# EAGLE design novice_shield_v1 (EAGLE 6.5.0)
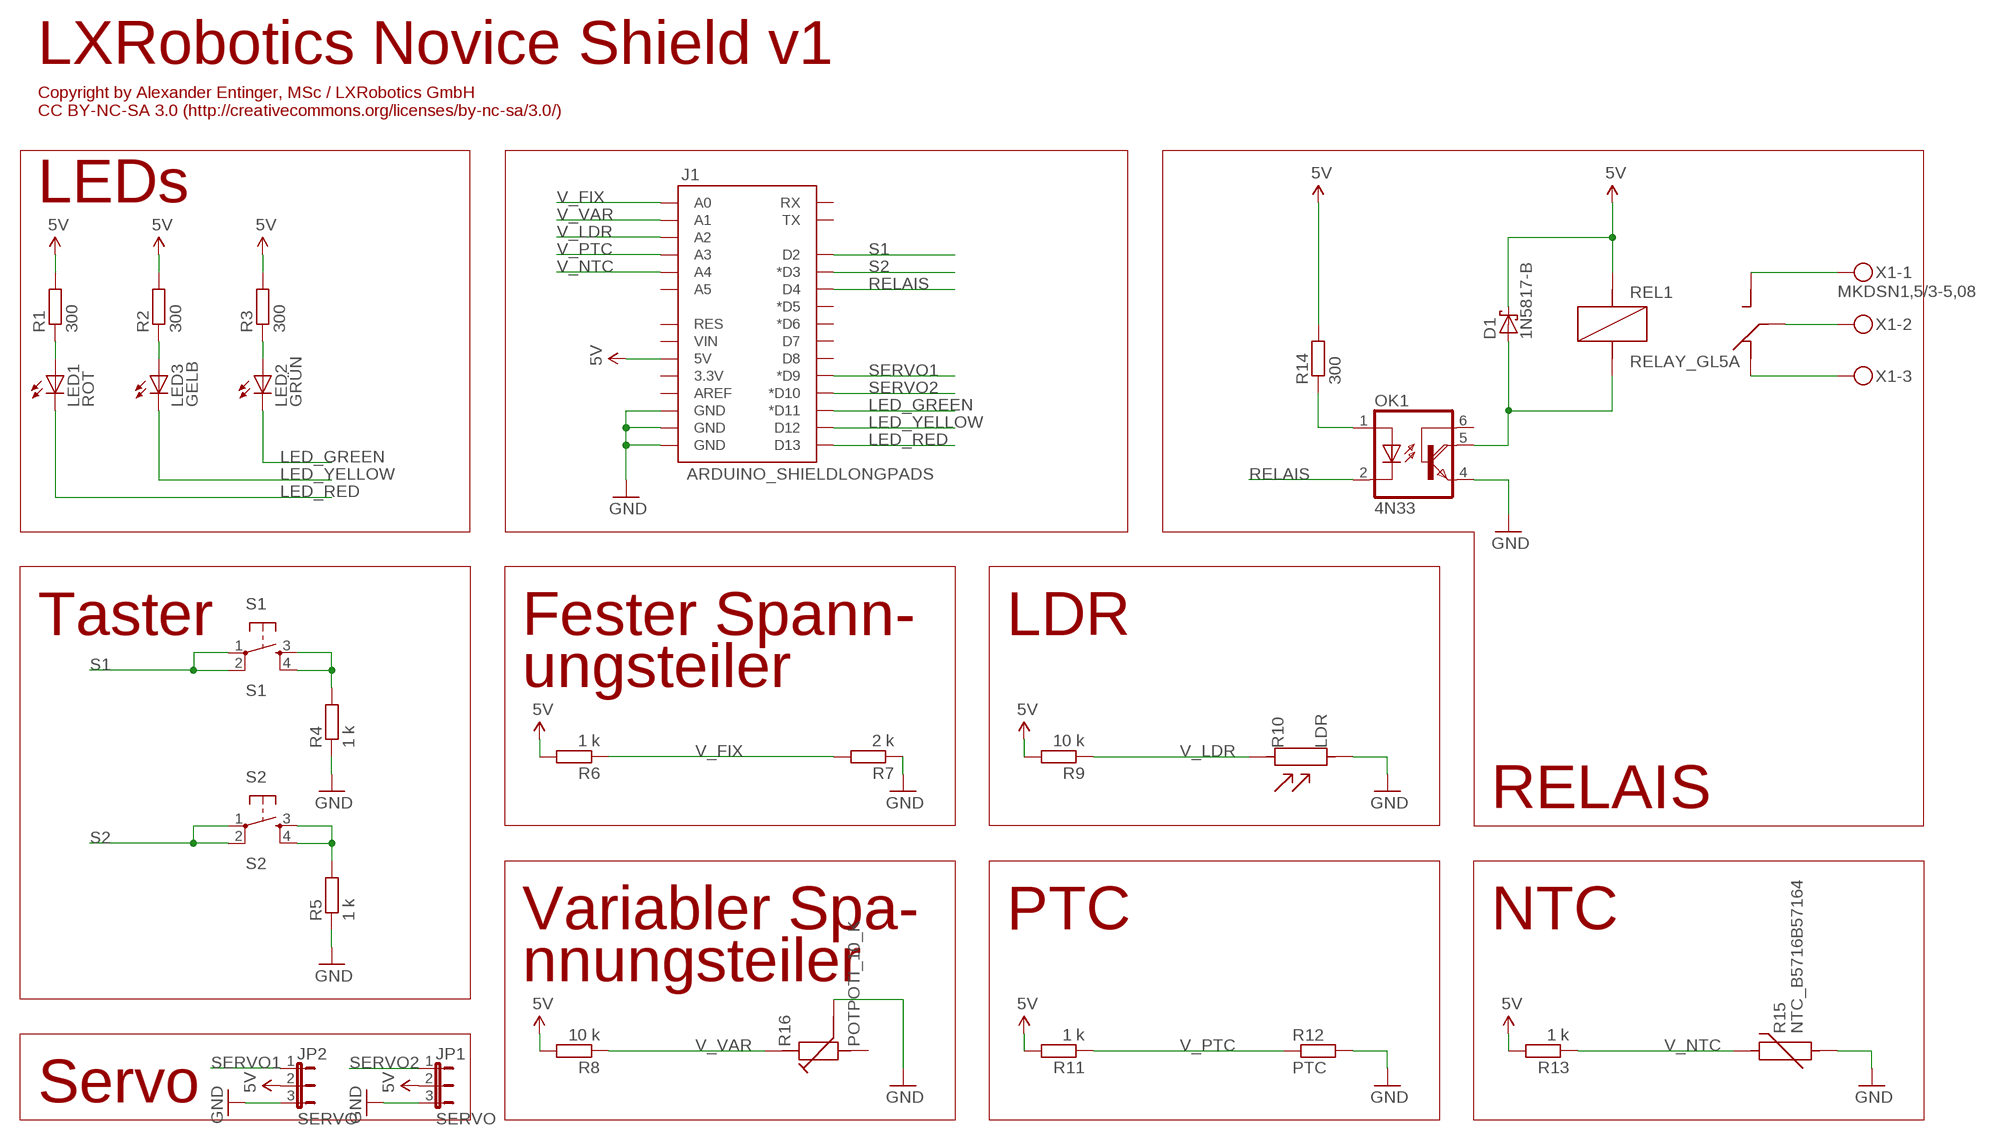
[diagram p0: schematic, sheet 1]

## Parts
D1  1N5817-B  [DO41-7.6]
J1  ARDUINO_SHIELDLONGPADS  [DUEMILANOVE_SHIELD_LONGPADS]
JP1  SERVO  JP2E  [JP2]
JP2  SERVO  JP2E  [JP2]
LED1  ROT  LED5MM  [LED5MM]
LED2  GRÜN  LED5MM  [LED5MM]
LED3  GELB  LED5MM  [LED5MM]
OK1  4N33  [DIL06]
R1  300  R-EU_0204/5  [0204/5]
R2  300  R-EU_0204/5  [0204/5]
R3  300  R-EU_0204/5  [0204/5]
R4  1 k  R-EU_0204/5  [0204/5]
R5  1 k  R-EU_0204/5  [0204/5]
R6  1 k  R-EU_0204/5  [0204/5]
R7  2 k  R-EU_0204/5  [0204/5]
R8  10 k  R-EU_0204/5  [0204/5]
R9  10 k  R-EU_0204/5  [0204/5]
R10  LDR  [LDR]
R11  1 k  R-EU_0204/5  [0204/5]
R12  PTC  R-EU_0207/10  [0207/10]
R13  1 k  R-EU_0204/5  [0204/5]
R14  300  R-EU_0204/5  [0204/5]
R15  NTC_B5716B57164  [NTC_5MM_RADIAL]
R16  POTPOTI_10_K  [POT_10K]
REL1  RELAY_GL5A  [RELAY_GL5A]
S1  S1  TAC_SWITCHPTH  [TACTILE-PTH]
S2  S2  TAC_SWITCHPTH  [TACTILE-PTH]
X1  MKDSN1,5/3-5,08  [MKDSN1,5/3-5,08]

## Nets
5V: D1.C J1.5V JP1.2 JP2.2 R1.2 R2.2 R3.2 R6.2 R8.2 R9.2 R11.2 R13.2 R14.2 REL1.R2(R2_COIL1)
GND: J1.GND@0(GND) J1.GND@1(GND) J1.GND@2(GND) JP1.3 JP2.3 OK1.4(E) R4.1 R5.1 R7.1 R10.P$2 R12.2 R15.P$2 R16.VAR
LED_GREEN: J1.D11(*D11) LED2.K(C)
LED_RED: J1.D13 LED1.K(C)
LED_YELLOW: J1.D12 LED3.K(C)
N$1: LED1.A R1.1
N$2: LED3.A R2.1
N$3: LED2.A R3.1
N$4: R4.2 S1.3 S1.4
N$5: R5.2 S2.3 S2.4
N$7: REL1.R4(R4_SW) X1.3
N$8: REL1.R1(R1_COMMON) X1.2
N$9: REL1.R3(R3_SW) X1.1
N$10: OK1.1(A) R14.1
N$11: D1.A OK1.5(COL) REL1.R5(R5_COIL2)
RELAIS: J1.D4 OK1.2(C)
S1: J1.D2 S1.1 S1.2
S2: J1.D3(*D3) S2.1 S2.2
SERVO1: J1.D9(*D9) JP2.1
SERVO2: J1.D10(*D10) JP1.1
V_FIX: J1.A0 R6.1 R7.2
V_LDR: J1.A2 R9.1 R10.P$1
V_NTC: J1.A4 R13.1 R15.P$1
V_PTC: J1.A3 R11.1 R12.1
V_VAR: J1.A1 R8.1 R16.S
Unconnected: J1.3.3V J1.A5 J1.AREF J1.D5(*D5) J1.D6(*D6) J1.D7 J1.D8 J1.RES J1.RX J1.TX J1.VIN OK1.6(B) R16.E

## Notes on the sheet
- LXRobotics Novice Shield v1
- Copyright by Alexander Entinger, MSc / LXRobotics GmbH 
  CC BY-NC-SA 3.0 (http://creativecommons.org/licenses/by-nc-sa/3.0/)
- LEDs
- Taster | Fester Spann- | LDR
- ungsteiler
- RELAIS
- Variabler Spa- | PTC | NTC
- nnungsteiler
- Servo

## Library data of the parts
D1 = diode:1N581*: 1.0A SCHOTTKY BARRIER RECTIFIER Source: http://www.diodes.com/datasheets/ds23001.pdf
J1 = SparkFun-Boards:ARDUINO_SHIELD: Arduino shield footprint
JP1 JP2 = jumper:JP2E: JUMPER
LED1-LED3 = led:LED: LED OSRAM: - CHIPLED LG R971, LG N971, LY N971, LG Q971, LY Q971, LO R971, LY R971 LH N974, LH R974 LS Q976, LO Q976, LY Q976 LO Q996 - Hyper CHIPLED LW Q18S LB Q993, LB Q99A, LB R99A - SideLED LS A670, LO A670, LY A670, LG A670, LP A670 LB A673, LV A673, LT A673, LW A673 LH A674 LY A675 LS A676, LA A676, LO A676, LY A676, LW A676 LS A679, LY A679, LG A679 - Hyper Micro SIDELED® LS Y876, LA Y876, LO Y876, LY Y876 LT Y87S - SmartLED LW L88C, LW L88S LB L89C, LB L89S, LG L890 LS L89K, LO L89K, LY L89K LS L896, LA L896, LO L896, LY L896 - TOPLED LS T670, LO T670, LY T670, LG T670, LP T670 LSG T670, LSP T670, LSY T670, LOP T670, LYG T670 LG T671, LOG T671, LSG T671 LB T673, LV T673, LT T673, LW T673 LH T674 LS T676, LA T676, LO T676, LY T676, LB T676, LH T676, LSB T676, LW T676 LB T67C, LV T67C, LT T67C, LS T67K, LO T67K, LY T67K, LW E67C LS E67B, LA E67B, LO E67B, LY E67B, LB E67C, LV E67C, LT E67C LW T67C LS T679, LY T679, LG T679 LS T770, LO T770, LY T770, LG T770, LP T770 LB T773, LV T773, LT T773, LW T773 LH T774 LS E675, LA E675, LY E675, LS T675 LS T776, LA T776, LO T776, LY T776, LB T776 LHGB T686 LT T68C, LB T68C - Hyper Mini TOPLED® LB M676 - Mini TOPLED Santana® LG M470 LS M47K, LO M47K, LY M47K Source: http://www.osram.convergy.de LUXEON: - LUMILED® LXK2-PW12-R00, LXK2-PW12-S00, LXK2-PW14-U00, LXK2-PW14-V00 LXK2-PM12-R00, LXK2-PM12-S00, LXK2-PM14-U00 LXK2-PE12-Q00, LXK2-PE12-R00, LXK2-PE12-S00, LXK2-PE14-T00, LXK2-PE14-U00 LXK2-PB12-K00, LXK2-PB12-L00, LXK2-PB12-M00, LXK2-PB14-N00, LXK2-PB14-P00, LXK2-PB14-Q00 LXK2-PR12-L00, LXK2-PR12-M00, LXK2-PR14-Q00, LXK2-PR14-R00 LXK2-PD12-Q00, LXK2-PD12-R00, LXK2-PD12-S00 LXK2-PH12-R00, LXK2-PH12-S00 LXK2-PL12-P00, LXK2-PL12-Q00, LXK2-PL12-R00 Source: www.luxeon.com KINGBRIGHT: KA-3528ASYC Source: www.kingbright.com
OK1 = optocoupler:4N33: MOTOROLA OPTO COUPLER; MF: VISHAY/TELEFUNKEN; MPN: 4N33; OC_FARNELL: 1469601; OC_NEWARK: 88K1390
R1-R9 R11-R14 = resistor:R-EU_: RESISTOR, European symbol
R10 = lxrobotics:LDR
R15 = lxrobotics_sensor:NTC_B5716
R16 = lxrobotics:POT
REL1 = lxrobotics:RELAY_GL5A
S1 S2 = SparkFun-Electromechanical:TAC_SWITCH: Momentary Switch Button commonly used for reset or general input. Spark Fun Electronics SKU : COM-00097 SMT- SWCH-08247
X1 = con-phoenix-508:MKDSN1,5/3-5,08: MKDSN 1,5/ 3-5,08 Printklemme Nennstrom: 13,5 A Nennspannung: 250 V Rastermaß: 5,08 mm Polzahl: 3 Anschlussart: Schraubanschluss Montage: Löten Anschlussrichtung Leiter/Platine: 0 ° Artikelnummer: 1729131 Source: http://eshop.phoenixcontact.com .. 1729131.pdf; MPN: SMKDSN1,5/3-5,08; OC_FARNELL: 1792904; OC_NEWARK: 70R0299

## Board
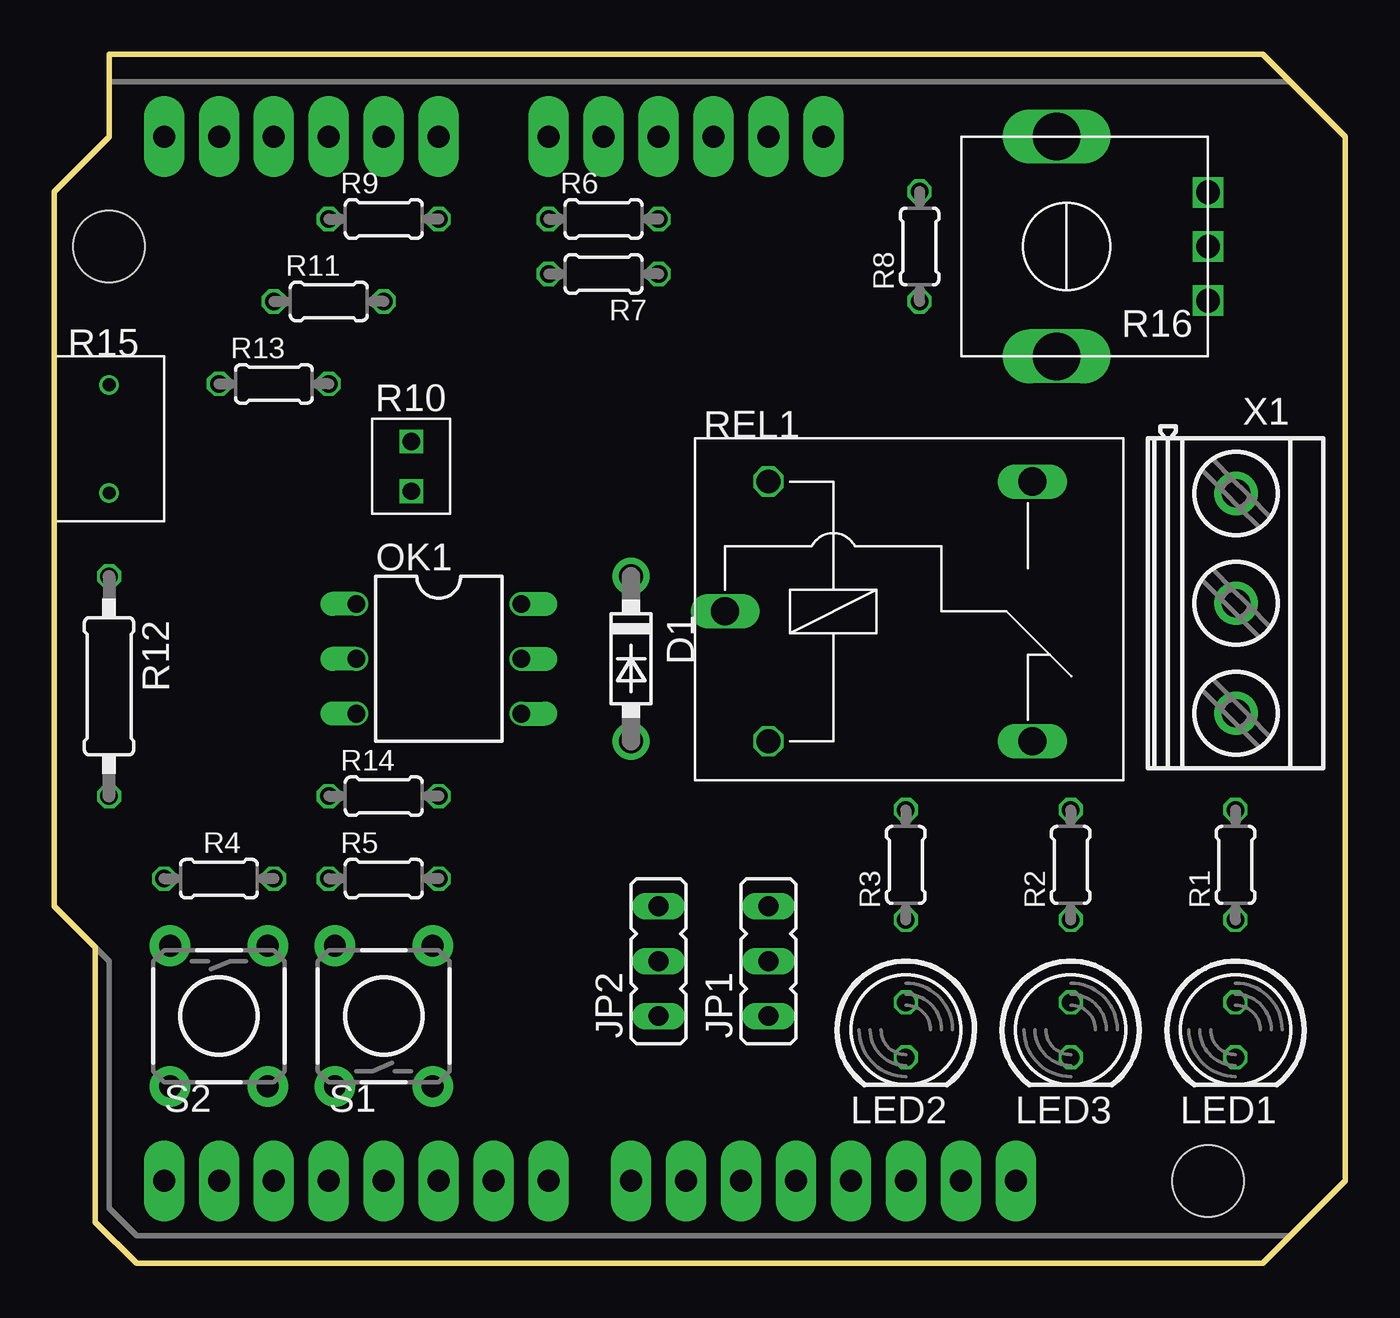
[diagram p1: board, top side]
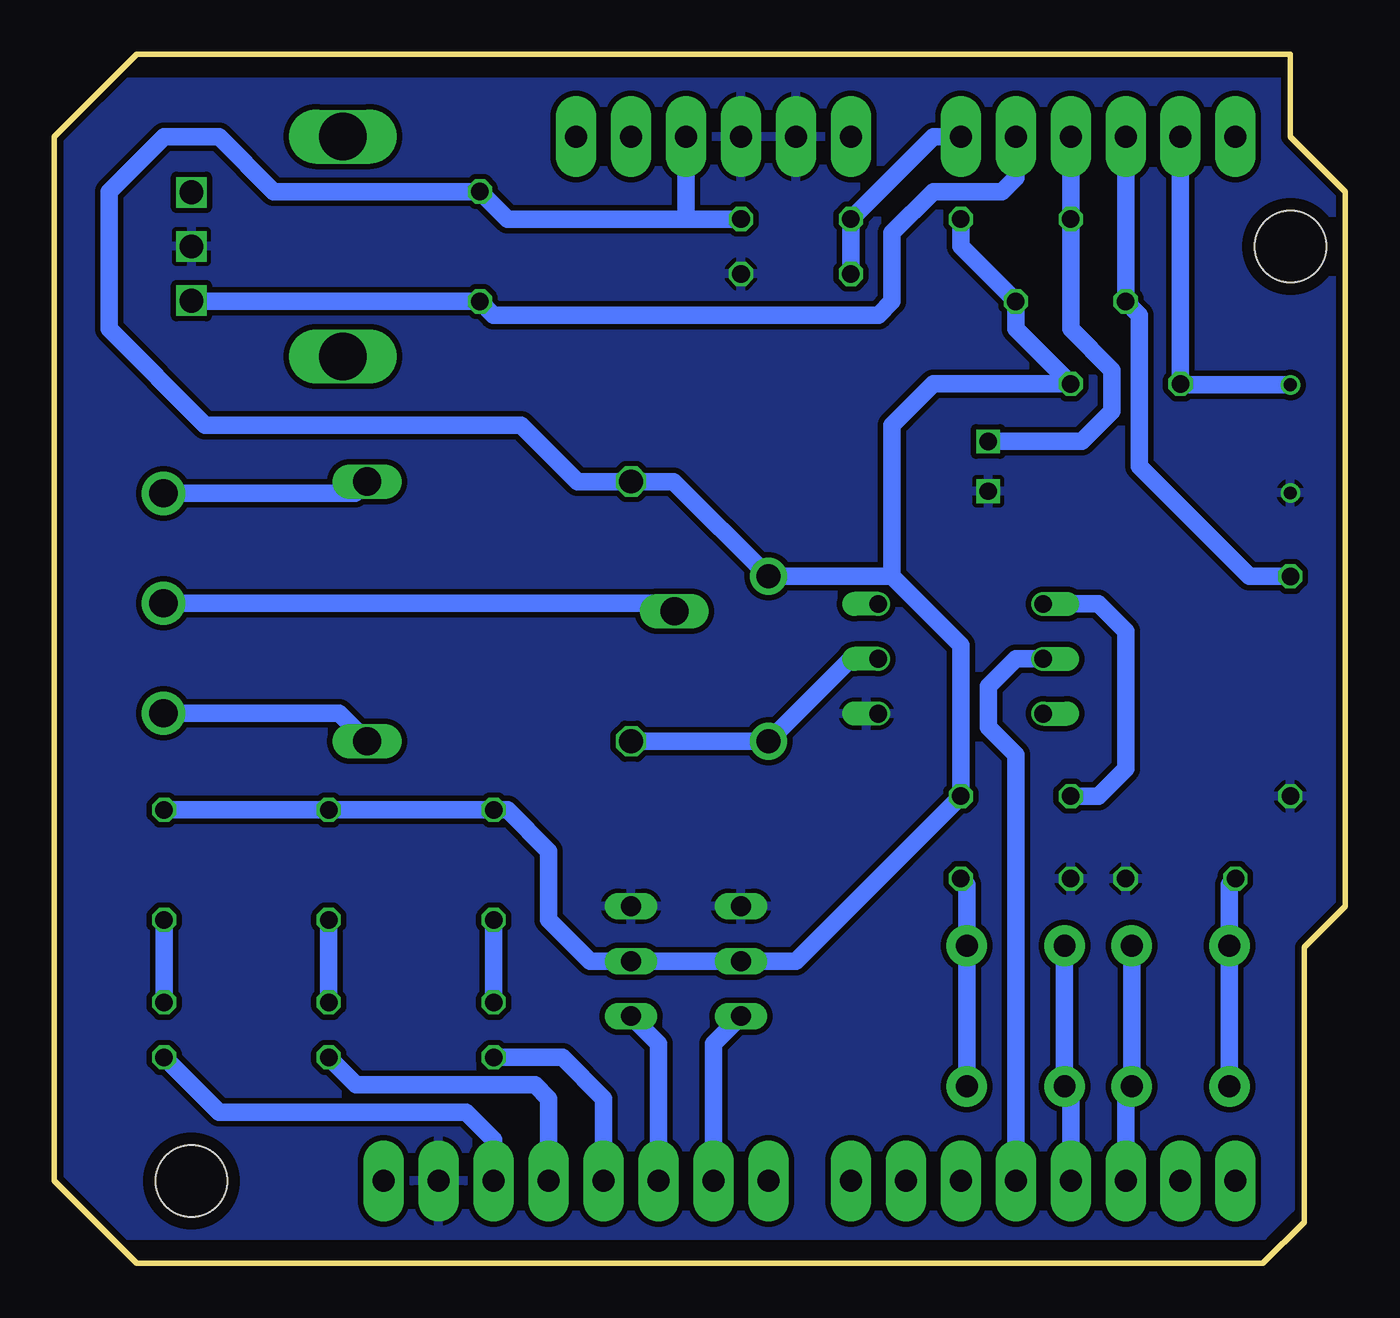
[diagram p2: board, bottom side, seen from below]

Size 59.69 x 55.88 mm. Coordinates in mm from the lower left corner, seen from the top.
Outline: 2.54,55.88 55.88,55.88 59.69,52.07 59.69,3.81 55.88,0 3.81,0 1.9,1.91 1.9,14.61 0,16.51 0,49.53 2.54,52.07 2.54,55.88
Copper layers (1*16): Top 0.035mm / dielectric 1.5mm / Bottom 0.035mm
Design rules "LeitOn - Standard-Eagle-DRU - 1- und  2-Lagen DK - deutsch - Rev 2.0": minimum track width 0.15mm, minimum drill 0.3mm, track to track 0.15mm, track to pad 0.15mm, pad to pad 0.15mm, via to via 0.15mm, smd to smd 0.15mm, copper to edge 0.3mm, drill to drill 0.3mm, minimum pad ring 0.15mm, minimum via ring 0.15mm, stop-mask expansion 0.075mm, vias tented up to drill 0mil, thermal gap 0.2mm

### Footprints (pad centres in the part's own frame; a part is rotated, then mirrored left to right if it is on the bottom)
DO41-7.6 = drill 1.1 pad 1.7: A 3.81,0; C -3.81,0
DUEMILANOVE_SHIELD_LONGPADS = drill 1.016 pad 1.88 long: 3.3V 50.8,26.67; 5V 50.8,29.21; A0 50.8,41.91; A1 50.8,44.45; A2 50.8,46.99; A3 50.8,49.53; A4 50.8,52.07; A5 50.8,54.61; AREF 2.54,15.24; D2 2.54,49.53; D3 2.54,46.99; D4 2.54,44.45; D5 2.54,41.91; D6 2.54,39.37; D7 2.54,36.83; D8 2.54,33.02; D9 2.54,30.48; D10 2.54,27.94; D11 2.54,25.4; D12 2.54,22.86; D13 2.54,20.32; GND@0 50.8,31.75; GND@1 50.8,34.29; GND@2 2.54,17.78; RES 50.8,24.13; RX 2.54,54.61; TX 2.54,52.07; VIN 50.8,36.83 | hole 3.302: 45.72,57.15; 2.54,6.35
JP2 = drill 0.914 long: 1 -2.54,0; 2 0,0; 3 2.54,0
LED5MM = drill 0.813 octagon: A -1.27,0; K 1.27,0
DIL06 = drill 0.813 offset: 1 -2.54,-3.81; 2 0,-3.81; 3 2.54,-3.81; 4 2.54,3.81; 5 0,3.81; 6 -2.54,3.81
0204/5 = drill 0.813 octagon: 1 -2.54,0; 2 2.54,0
LDR = drill 0.8 square: P$1 -1.15,0; P$2 1.15,0
0207/10 = drill 0.813 octagon: 1 -5.08,0; 2 5.08,0
NTC_5MM_RADIAL = drill 0.6: P$1 -2.5,0; P$2 2.5,0
POT_10K = drill 1.1 square: E 2.5,0; S -2.5,0; VAR 0,0 | drill 2.2 long: P$1 -5.08,7; P$2 5.08,7
RELAY_GL5A = drill 1.3 long: R1 -2,6; R3 12.2,12; R4 12.2,0 | drill 1.1 octagon: R2 0,12; R5 0,0
TACTILE-PTH = drill 1.016 pad 1.88: 1 -3.251,2.261; 2 3.251,2.261; 3 -3.251,-2.261; 4 3.251,-2.261
MKDSN1,5/3-5,08 = drill 1.3 pad 2: 1 -7.641,0.025; 2 -2.561,0.025; 3 2.519,0.025

### Placement (x,y rotation side)
D1  26.67,27.94 270 top
J1  59.69,1.27 90 top
JP1  33.02,13.97 90 top
JP2  27.94,13.97 90 top
LED1  54.61,10.8 270 top
LED2  39.37,10.8 270 top
LED3  46.99,10.8 270 top
OK1  17.78,27.94 270 top
R1  54.61,18.41 90 top
R2  46.99,18.41 90 top
R3  39.37,18.41 90 top
R4  7.62,17.78 180 top
R5  15.24,17.78 0 top
R6  25.4,48.26 0 top
R7  25.4,45.72 180 top
R8  40,46.99 90 top
R9  15.24,48.26 0 top
R10  16.51,36.83 270 top
R11  12.7,44.45 0 top
R12  2.54,26.67 270 top
R13  10.16,40.64 0 top
R14  15.24,21.59 0 top
R15  2.54,38.1 270 top
R16  53.34,46.99 90 top
REL1  33.02,24.13 0 top
S1  7.62,11.43 270 top
S2  15.24,11.43 90 top
X1  54.61,27.94 270 top

### Tracks (layer width: path | path; a pad name or v marks a point on that pad's centre or on a via)
5V
  Bottom 0.813: R1.2 R2.2 R3.2 38.73,20.95 36.83,19.05 36.83,15.88 34.92,13.97 JP1.2 JP2.2 25.4,13.97 R14.2 17.78,28.58 20.95,31.75 | R9.2 17.78,46.99 R11.2 15.24,43.18 R13.2 19.05,40.64 20.95,38.73 20.95,31.75 | 20.95,31.75 D1.C 31.05,36.13 REL1.R2 35.49,36.13 38.1,38.73 52.7,38.73 57.15,43.18 57.15,49.53 54.61,52.07 52.07,52.07 49.53,49.53 R8.2 38.73,48.26 30.48,48.26 | R6.2 30.48,48.26 | J1.5V 30.48,48.26
GND
  pour Bottom (isolate 0.254): 3.81,1.27 57.15,1.27 59.69,3.81 59.69,52.07 57.15,54.61 2.54,54.61 2.54,52.07 0,49.53 0,16.51 2.54,13.97 2.54,2.54
LED_GREEN
  Bottom 0.813: J1.D11 34.29,7.62 36.2,9.52 LED2.K
LED_RED
  Bottom 0.813: J1.D13 39.37,5.71 40.64,6.98 52.07,6.98 LED1.K
LED_YELLOW
  Bottom 0.813: J1.D12 36.83,7.62 37.46,8.25 45.72,8.25 LED3.K
N$1
  Bottom 0.813: R1.1 LED1.A
N$2
  Bottom 0.813: R2.1 LED3.A
N$3
  Bottom 0.813: LED2.A R3.1
N$4
  Bottom 0.813: S1.4 S1.3 5.36,17.5 R4.2
N$5
  Bottom 0.813: S2.3 S2.4 17.5,17.5 R5.2
N$7
  Bottom 0.813: X1.3 46.51,25.42 REL1.R4
N$8
  Bottom 0.813: X1.2 31.39,30.5 REL1.R1
N$9
  Bottom 0.813: X1.1 45.77,35.58 REL1.R3
N$10
  Bottom 0.813: R14.1 11.43,21.59 10.16,22.86 10.16,29.21 11.43,30.48 OK1.1
N$11
  Bottom 0.813: REL1.R5 D1.A 22.86,27.94 OK1.5
RELAIS
  Bottom 0.813: J1.D4 15.24,23.49 16.51,24.77 16.51,26.67 15.24,27.94 OK1.2
S1
  Bottom 0.813: J1.D2 10.16,7.9 S1.2 S1.1
S2
  Bottom 0.813: J1.D3 12.7,7.9 S2.1 S2.2
SERVO1
  Bottom 0.813: J1.D9 29.21,10.16 JP2.1
SERVO2
  Bottom 0.813: J1.D10 31.75,10.16 JP1.1
V_FIX
  Bottom 0.813: R7.2 R6.1 19.05,52.07 J1.A0
V_LDR
  Bottom 0.813: J1.A2 R9.1 12.7,43.18 10.79,41.27 10.79,39.37 12.19,37.98 R10.P$1
V_NTC
  Bottom 0.813: J1.A4 R13.1 7.58,40.6 R15.P$1
V_PTC
  Bottom 0.813: J1.A3 R11.1 9.53,43.81 9.53,36.83 4.44,31.75 R12.1
V_VAR
  Bottom 0.813: J1.A1 15.24,50.16 15.87,49.53 19.05,49.53 20.95,47.62 20.95,44.45 21.59,43.81 39.37,43.81 R8.1 53.3,44.45 R16.S